# Altium schematic sheet KV2_MotionA345.SchDoc
size A3; PageSetup: Record=PageOptions|CenterHorizontal=True|CenterVertical=True|PrintScale=1.00|XCorrection=1.00|YCorrection=1.00|PrintKind=2|BorderSize=5000000|LeftOffset=0|BottomOffset=0|Orientation=2|PaperLength=1000|PaperWidth=1000|Scale=100|PaperSource=7|PrintQuality=-4|MediaType=1|DitherType=10|PaperKind=A3|PrintScaleMode=1
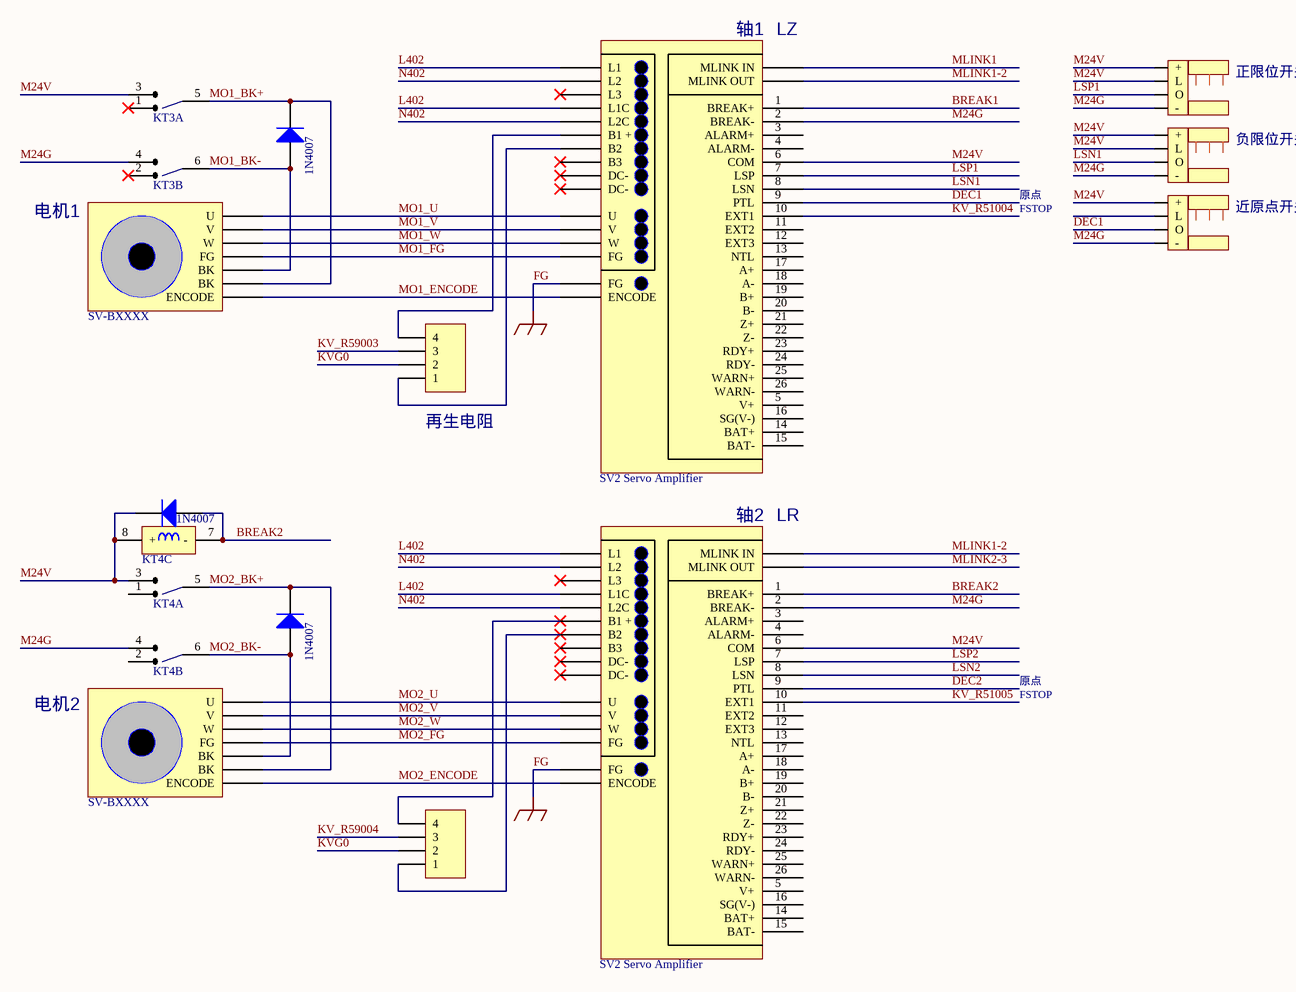
[diagram p0: KV2_MotionA345.SchDoc]

## Parts
(Parts that share a designator on the sheet are numbered #1, #2 ... from top to bottom, then left to right.)
*#1  SV2 Servo Amplifier
*#2  SV-BXXXX
*#3  SV2 Servo Amplifier
*#4  SV-BXXXX
D?#1  1N4007  [DO-41]
D?#2  1N4007  [DO-41]
D?#3  1N4007  [DO-41]
KT3  LY2N-J  (value not drawn)  (parts A,B of 3)
KT4  LY2N-J  (value not drawn)  (parts A,B,C of 3)
P?#1  Header 4  [HDR1X4]  (value not drawn)
P?#2  Header 4  [HDR1X4]  (value not drawn)
原点光纤传感器#1  OMRON  E3X-HD  (value not drawn)
原点光纤传感器#2  OMRON  E3X-HD  (value not drawn)
原点光纤传感器#3  OMRON  E3X-HD  (value not drawn)

## Nets
FG: *#1.X43(FG) *#3.X43(FG)  [also labelled GND]
BREAK1: *#1.1(BREAK+)
BREAK2: *#3.1(BREAK+) D?#2.1(A) KT4.7(-)
DEC1: *#1.9(PTL) 原点光纤传感器#3.91(O)
DEC2: *#3.9(PTL)
KV_R51004: *#1.10(EXT1)
KV_R51005: *#3.10(EXT1)
KV_R59003: P?#1.3
KV_R59004: P?#2.3
KVG0: P?#1.2 P?#2.2
L402: *#1.X34(L1) *#1.X37(L1C) *#3.X34(L1) *#3.X37(L1C)
LSN1: *#1.8(LSN) 原点光纤传感器#2.91(O)
LSN2: *#3.8(LSN)
LSP1: *#1.7(LSP) 原点光纤传感器#1.91(O)
LSP2: *#3.7(LSP)
M24G: *#1.2(BREAK-) *#3.2(BREAK-) KT3.4 KT4.4 原点光纤传感器#1.92(-) 原点光纤传感器#2.92(-) 原点光纤传感器#3.92(-)
M24V: *#1.6(COM) *#3.6(COM) D?#2.2(K) KT3.3 KT4.3 KT4.8(+) 原点光纤传感器#1.89(+) 原点光纤传感器#1.90(L) 原点光纤传感器#2.89(+) 原点光纤传感器#2.90(L) 原点光纤传感器#3.89(+)
MLINK1: *#1.X44(MLINK_IN)
MLINK1-2: *#1.X44(MLINK_OUT) *#3.X44(MLINK_IN)
MLINK2-3: *#3.X44(MLINK_OUT)
MO1_BK+: *#2.31(BK) D?#1.2(K) KT3.5
MO1_BK-: *#2.30(BK) D?#1.1(A) KT3.6
MO1_ENCODE: *#1.X44(ENCODE) *#2.29(ENCODE)
MO1_FG: *#1.X43(FG) *#2.29(FG)
MO1_U: *#1.X43(DC-) *#2.27(U)
MO1_V: *#1.X43(V) *#2.28(V)
MO1_W: *#1.X43(W) *#2.29(W)
MO2_BK+: *#4.31(BK) D?#3.2(K) KT4.5
MO2_BK-: *#4.30(BK) D?#3.1(A) KT4.6
MO2_ENCODE: *#3.X44(ENCODE) *#4.29(ENCODE)
MO2_FG: *#3.X43(FG) *#4.29(FG)
MO2_U: *#3.X43(DC-) *#4.27(U)
MO2_V: *#3.X43(V) *#4.28(V)
MO2_W: *#3.X43(W) *#4.29(W)
N402: *#1.X35(L2) *#1.X38(L2C) *#3.X35(L2) *#3.X38(L2C)
Net*#1_X39: *#1.X39(B1_+) P?#1.4
Net*#1_X40: *#1.X40(B2) P?#1.1
Net*#3_X39: *#3.X39(B1_+) P?#2.4
Net*#3_X40: *#3.X40(B2) P?#2.1

Not connected (* = marked no-connect by the designer): *#1 3(ALARM+) 4(ALARM-) 5(V+) 11(EXT2) 12(EXT3) 13(NTL) 14(BAT+) 15(BAT-) 16(SG(V-)) 17(A+) 18(A-) 19(B+) 20(B-) 21(Z+) 22(Z-) 23(RDY+) 24(RDY-) 25(WARN+) 26(WARN-) X36(L3)* X41(B3)* X42(DC-)*; *#3 3(ALARM+) 4(ALARM-) 5(V+) 11(EXT2) 12(EXT3) 13(NTL) 14(BAT+) 15(BAT-) 16(SG(V-)) 17(A+) 18(A-) 19(B+) 20(B-) 21(Z+) 22(Z-) 23(RDY+) 24(RDY-) 25(WARN+) 26(WARN-) X36(L3)* X41(B3)* X42(DC-)*; KT3 1* 2*; KT4 1 2; 原点光纤传感器#3 90(L)

## Notes on the sheet
- (near *#1) 轴1
- (near *#1) LZ
- 正限位开关
- 负限位开关
- 电机1
- 原点
- FSTOP
- 近原点开关
- (near P?#1) 再生电阻
- (near *#3) 轴2
- (near *#3) LR
- 电机2

## Library data of the parts
D?#1-D?#3 = Diode 1N4007: 1 Amp General Purpose Rectifier; Published: 8-Jun-2000; LatestRevisionDate: 17-Jul-2002; LatestRevisionNote: Re-released for DXP Platform.; DatasheetVersion: 1998; PackageVersion: Aug-1999; PackageReference: DO-41; Publisher: Altium Limited; PackageDescription: Diode, Axial; Body 5.2 x 2.7 mm (LxDia. max), Lead Dia. 0.86 mm (max); Code_JEDEC: DO-204-AL; ComponentLink1Description: Manufacturer Link; ComponentLink1URL: http://www.fairchildsemi.com/; ComponentLink2Description: Datasheet; ComponentLink2URL: http://www.fairchildsemi.com/ds/1N%2F1N4001.pdf
P?#1 P?#2 = Header 4: Header, 4-Pin; LatestRevisionDate: 17-Jul-2002; LatestRevisionNote: Re-released for DXP Platform.; Publisher: Altium Limited
原点光纤传感器#1-原点光纤传感器#3 = OMRON_EE-SX671